# Altium schematic sheet Peripherial_Bus.SchDoc: Peripheral Bus
size Tabloid; Date: 03/13/2023; Engineer: Terry D. Schevker; Revision: 1.0; SheetNumber: 4; SheetTotal: 8
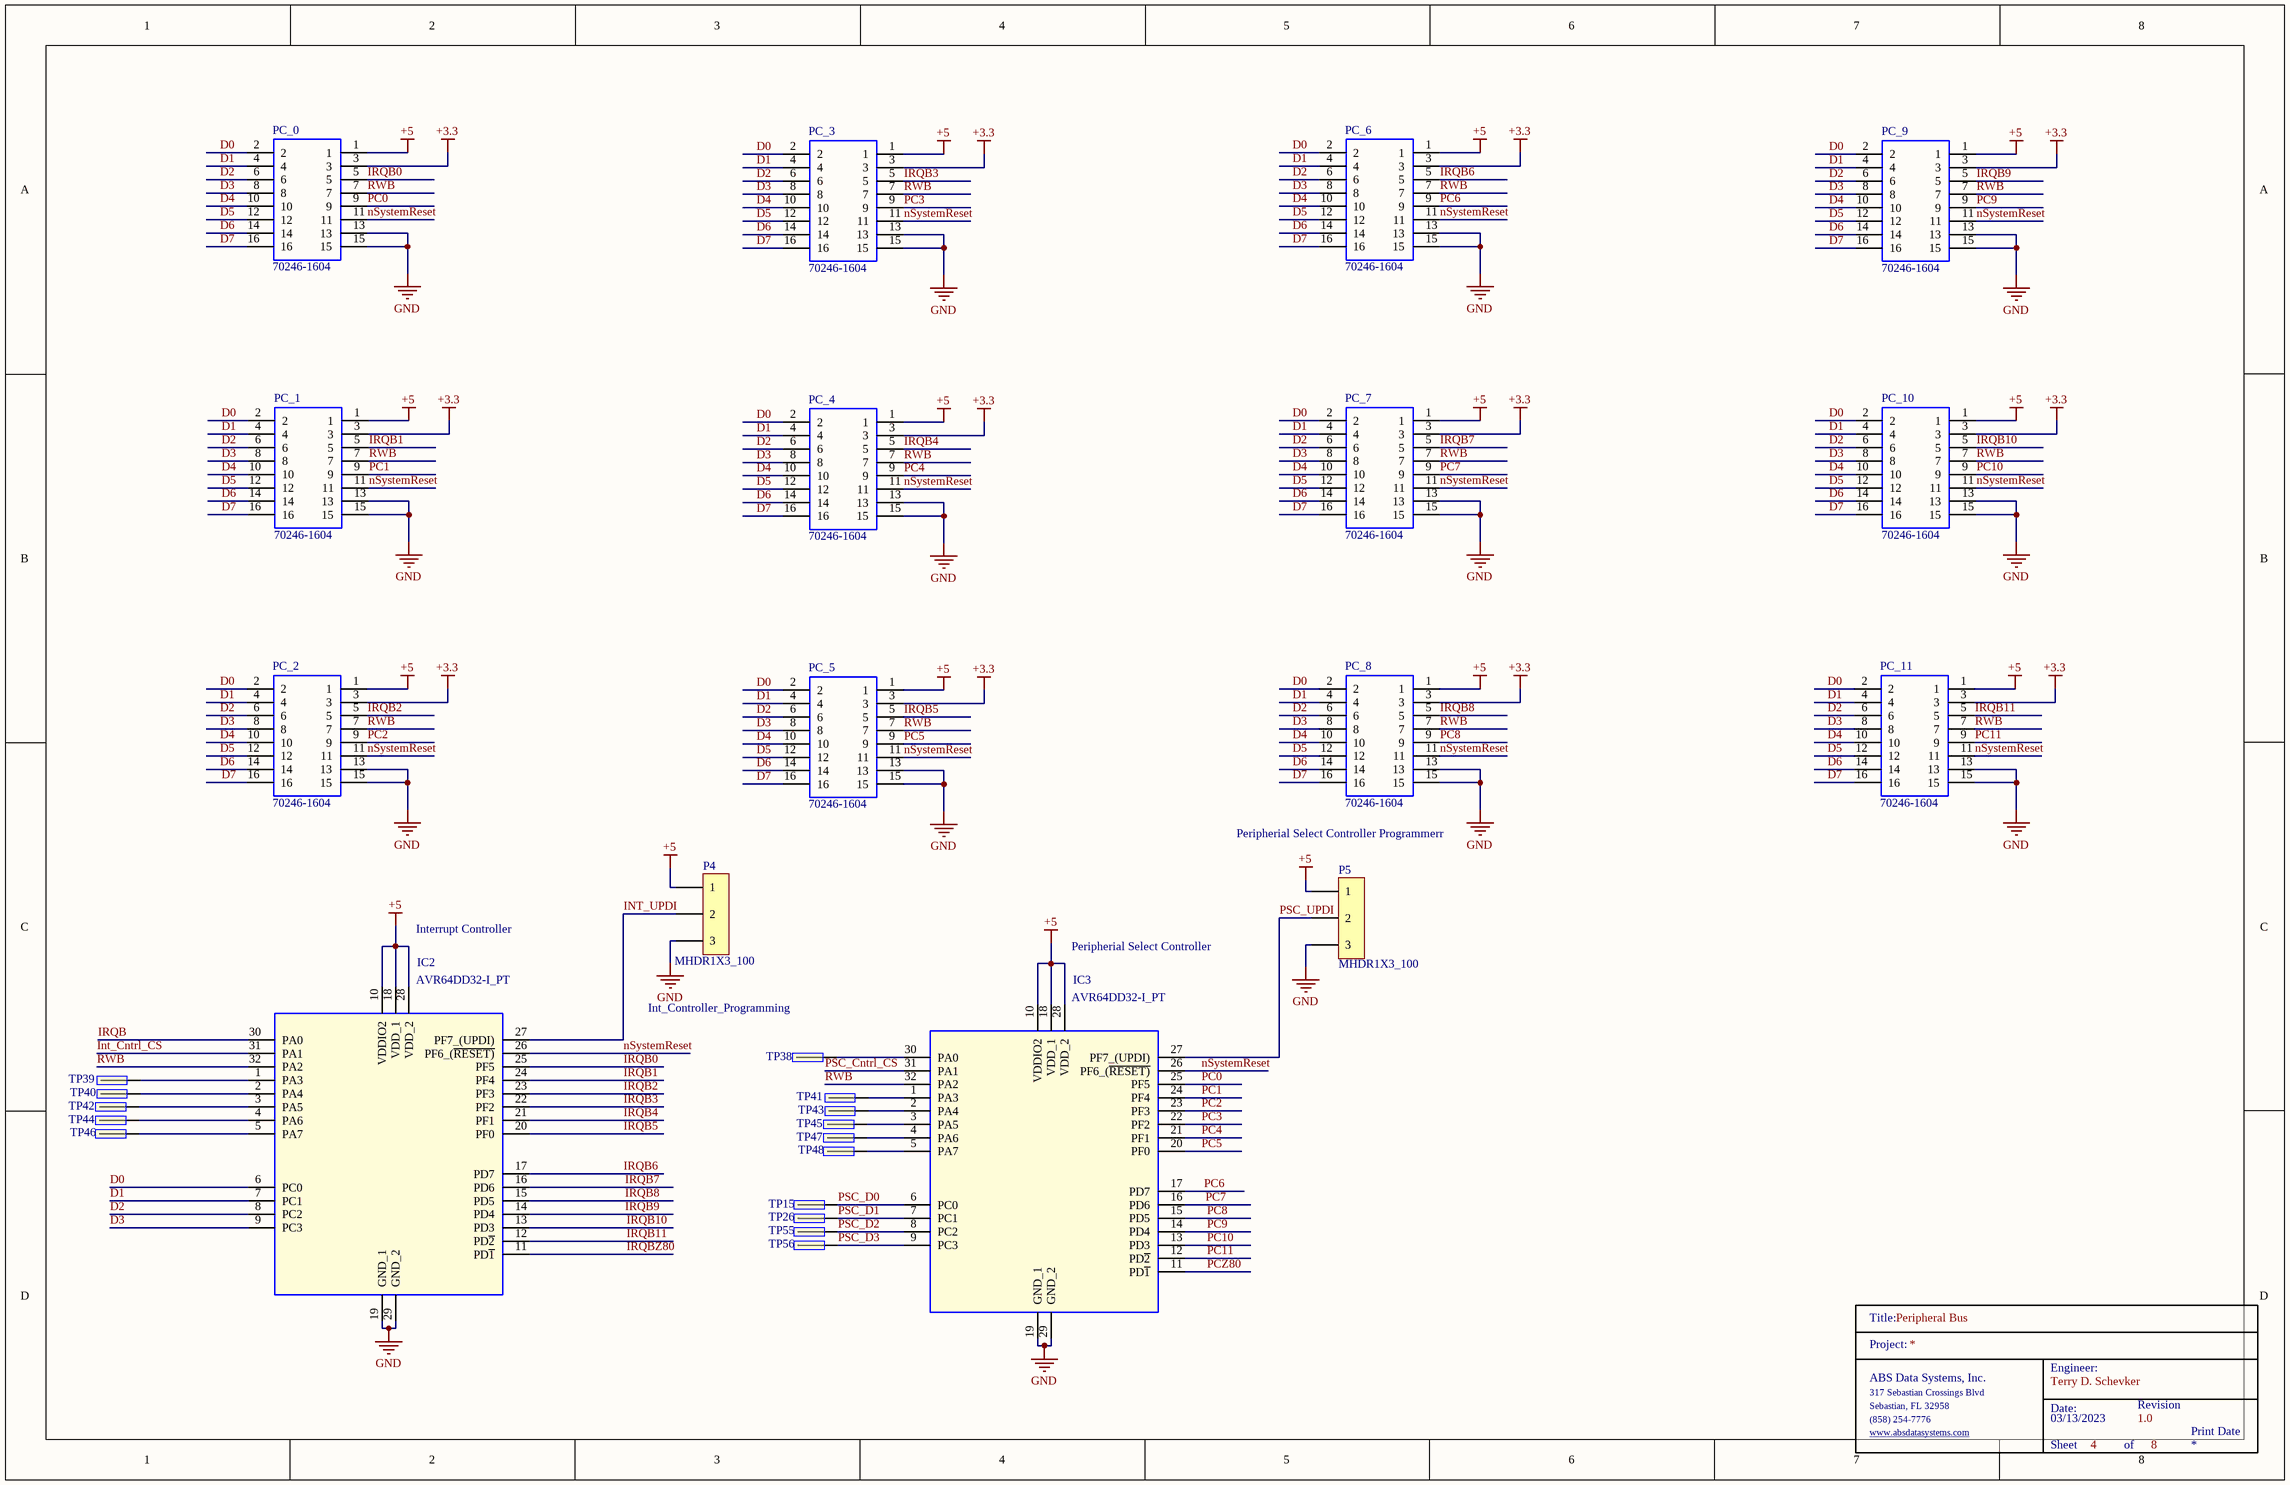
[diagram p0: Peripherial_Bus.SchDoc]

## Parts
IC2  AVR64DD32-I_PT  [QFP80P900X900X120-32N]
IC3  AVR64DD32-I_PT  [QFP80P900X900X120-32N]
P4  MHDR1X3_100  [MHDR1X3_100]
P5  MHDR1X3_100  [MHDR1X3_100]
PC_0  70246-1604  [SHDR16W99P254_2X8_2794X889X927P]
PC_1  70246-1604  [SHDR16W99P254_2X8_2794X889X927P]
PC_2  70246-1604  [SHDR16W99P254_2X8_2794X889X927P]
PC_3  70246-1604  [SHDR16W99P254_2X8_2794X889X927P]
PC_4  70246-1604  [SHDR16W99P254_2X8_2794X889X927P]
PC_5  70246-1604  [SHDR16W99P254_2X8_2794X889X927P]
PC_6  70246-1604  [SHDR16W99P254_2X8_2794X889X927P]
PC_7  70246-1604  [SHDR16W99P254_2X8_2794X889X927P]
PC_8  70246-1604  [SHDR16W99P254_2X8_2794X889X927P]
PC_9  70246-1604  [SHDR16W99P254_2X8_2794X889X927P]
PC_10  70246-1604  [SHDR16W99P254_2X8_2794X889X927P]
PC_11  70246-1604  [SHDR16W99P254_2X8_2794X889X927P]
TitleBlock_6  TitleBlock  (value not drawn)  (graphical)
TP15  TP  [TP]  (value not drawn)
TP26  TP  [TP]  (value not drawn)
TP38  TP  [TP]  (value not drawn)
TP39  TP  [TP]  (value not drawn)
TP40  TP  [TP]  (value not drawn)
TP41  TP  [TP]  (value not drawn)
TP42  TP  [TP]  (value not drawn)
TP43  TP  [TP]  (value not drawn)
TP44  TP  [TP]  (value not drawn)
TP45  TP  [TP]  (value not drawn)
TP46  TP  [TP]  (value not drawn)
TP47  TP  [TP]  (value not drawn)
TP48  TP  [TP]  (value not drawn)
TP55  TP  [TP]  (value not drawn)
TP56  TP  [TP]  (value not drawn)

## Nets
+3.3: PC_0.3 PC_1.3 PC_2.3 PC_3.3 PC_4.3 PC_5.3 PC_6.3 PC_7.3 PC_8.3 PC_9.3 PC_10.3 PC_11.3
+5: IC2.10(VDDIO2) IC2.18(VDD_1) IC2.28(VDD_2) IC3.10(VDDIO2) IC3.18(VDD_1) IC3.28(VDD_2) P4.1 P5.1 PC_0.1 PC_1.1 PC_2.1 PC_3.1 PC_4.1 PC_5.1 PC_6.1 PC_7.1 PC_8.1 PC_9.1 PC_10.1 PC_11.1
GND: IC2.19(GND_1) IC2.29(GND_2) IC3.19(GND_1) IC3.29(GND_2) P4.3 P5.3 PC_0.13 PC_0.15 PC_1.13 PC_1.15 PC_2.13 PC_2.15 PC_3.13 PC_3.15 PC_4.13 PC_4.15 PC_5.13 PC_5.15 PC_6.13 PC_6.15 PC_7.13 PC_7.15 PC_8.13 PC_8.15 PC_9.13 PC_9.15 PC_10.13 PC_10.15 PC_11.13 PC_11.15
D0: IC2.6(PC0) PC_0.2 PC_1.2 PC_2.2 PC_3.2 PC_4.2 PC_5.2 PC_6.2 PC_7.2 PC_8.2 PC_9.2 PC_10.2 PC_11.2
D1: IC2.7(PC1) PC_0.4 PC_1.4 PC_2.4 PC_3.4 PC_4.4 PC_5.4 PC_6.4 PC_7.4 PC_8.4 PC_9.4 PC_10.4 PC_11.4
D2: IC2.8(PC2) PC_0.6 PC_1.6 PC_2.6 PC_3.6 PC_4.6 PC_5.6 PC_6.6 PC_7.6 PC_8.6 PC_9.6 PC_10.6 PC_11.6
D3: IC2.9(PC3) PC_0.8 PC_1.8 PC_2.8 PC_3.8 PC_4.8 PC_5.8 PC_6.8 PC_7.8 PC_8.8 PC_9.8 PC_10.8 PC_11.8
D4: PC_0.10 PC_1.10 PC_2.10 PC_3.10 PC_4.10 PC_5.10 PC_6.10 PC_7.10 PC_8.10 PC_9.10 PC_10.10 PC_11.10
D5: PC_0.12 PC_1.12 PC_2.12 PC_3.12 PC_4.12 PC_5.12 PC_6.12 PC_7.12 PC_8.12 PC_9.12 PC_10.12 PC_11.12
D6: PC_0.14 PC_1.14 PC_2.14 PC_3.14 PC_4.14 PC_5.14 PC_6.14 PC_7.14 PC_8.14 PC_9.14 PC_10.14 PC_11.14
D7: PC_0.16 PC_1.16 PC_2.16 PC_3.16 PC_4.16 PC_5.16 PC_6.16 PC_7.16 PC_8.16 PC_9.16 PC_10.16 PC_11.16
Int_Cntrl_CS: IC2.31(PA1)
INT_UPDI: IC2.27(PF7_(UPDI)) P4.2
IRQB: IC2.30(PA0)
IRQB0: IC2.25(PF5) PC_0.5
IRQB1: IC2.24(PF4) PC_1.5
IRQB2: IC2.23(PF3) PC_2.5
IRQB3: IC2.22(PF2) PC_3.5
IRQB4: IC2.21(PF1) PC_4.5
IRQB5: IC2.20(PF0) PC_5.5
IRQB6: IC2.17(PD7) PC_6.5
IRQB7: IC2.16(PD6) PC_7.5
IRQB8: IC2.15(PD5) PC_8.5
IRQB9: IC2.14(PD4) PC_9.5
IRQB10: IC2.13(PD3) PC_10.5
IRQB11: IC2.12(PD~{2}) PC_11.5
IRQBZ80: IC2.11(PD~{1})
nSystemReset: IC2.26(PF6_(~{RESET)}) IC3.26(PF6_(~{RESET)}) PC_0.11 PC_1.11 PC_2.11 PC_3.11 PC_4.11 PC_5.11 PC_6.11 PC_7.11 PC_8.11 PC_9.11 PC_10.11 PC_11.11
PC0: IC3.25(PF5) PC_0.9
PC1: IC3.24(PF4) PC_1.9
PC2: IC3.23(PF3) PC_2.9
PC3: IC3.22(PF2) PC_3.9
PC4: IC3.21(PF1) PC_4.9
PC5: IC3.20(PF0) PC_5.9
PC6: IC3.17(PD7) PC_6.9
PC7: IC3.16(PD6) PC_7.9
PC8: IC3.15(PD5) PC_8.9
PC9: IC3.14(PD4) PC_9.9
PC10: IC3.13(PD3) PC_10.9
PC11: IC3.12(PD~{2}) PC_11.9
PCZ80: IC3.11(PD~{1})
PSC_Cntrl_CS: IC3.31(PA1)
PSC_D0: IC3.6(PC0) TP15.1
PSC_D1: IC3.7(PC1) TP26.1
PSC_D2: IC3.8(PC2) TP55.1
PSC_D3: IC3.9(PC3) TP56.1
PSC_UPDI: IC3.27(PF7_(UPDI)) P5.2
RWB: IC2.32(PA2) IC3.32(PA2) PC_0.7 PC_1.7 PC_2.7 PC_3.7 PC_4.7 PC_5.7 PC_6.7 PC_7.7 PC_8.7 PC_9.7 PC_10.7 PC_11.7
NetIC2_1: IC2.1(PA3) TP39.1
NetIC2_2: IC2.2(PA4) TP40.1
NetIC2_3: IC2.3(PA5) TP42.1
NetIC2_4: IC2.4(PA6) TP44.1
NetIC2_5: IC2.5(PA7) TP46.1
NetIC3_1: IC3.1(PA3) TP41.1
NetIC3_2: IC3.2(PA4) TP43.1
NetIC3_3: IC3.3(PA5) TP45.1
NetIC3_4: IC3.4(PA6) TP47.1
NetIC3_5: IC3.5(PA7) TP48.1
NetIC3_30: IC3.30(PA0) TP38.1

## Notes on the sheet
- Peripherial Select Controller Programmerr
- Interrupt Controller
- Peripherial Select Controller
- Int_Controller_Programming
- Print Date
- (in symbol TitleBlock) Title:; Project:; Engineer:; ABS Data Systems, Inc.; 317 Sebastian Crossings Blvd; Sebastian, FL 32958; Date:; Revision; (858) 254-7776; www.absdatasystems.com; Sheet; of

## Library data of the parts
IC2 IC3 = AVR64DD32-I_PT: Integrated Circuit; Manufacturer_Name: Microchip; Manufacturer_Part_Number: AVR64DD32-I/PT | MULTI-VOLTAGE I/O; Datasheet Link: https://www.microchip.com/en-us/product/AVR64DD32; Height: 1.2mm
P4 P5 = MHDR1X3_100: Header, 3-Pin; LatestRevisionDate: 17-Jul-2002; LatestRevisionNote: Re-released for DXP Platform.; Publisher: Altium Limited
PC_0-PC_11 = 70246-1604: Molex C-GRID 70246, 2.54mm Pitch, 16 Way, 2 Row, Straight PCB Header, Through Hole; Geometry.Height: 9.27mm; Mouser Part Number: 538-70246-1604; Mouser Price/Stock: https://www.mouser.co.uk/ProductDetail/Molex/70246-1604?qs=KUIzHt%2Fe91njhb67Cjmalw%3D%3D; Manufacturer_Name: Molex; Manufacturer_Part_Number: 70246-1604; Datasheet Link: https://www.molex.com/pdm_docs/sd/702461604_sd.pdf
TP15 TP26 TP38-TP48 TP55 TP56 = TP: Manufacturer: Samtec; Manufacturer Part Number: TST-105-01-G-D; Number of Contacts: 16; Gender: Male; Connector Type: Male Pin; Pitch: 2.54mm; Row Spacing: 0.1inch; Supplier 1: Digi-Key; RoHS: Yes; Category: Headers and Wire Housings; Stock 1: 227; Pricing 1: 1=2.85000, 10=2.73600, 100=2.28000, 500=1.93800, 1000=1.65300, 5000=1.48200 (USD); Mount: Through Hole; Contact Plating: Gold; Contact Material: Bronze; Housing Material: Polyester; Housing Color: Black; Color: Black; Min Operating Temperature: -55°C; Max Operating Temperature: 125°C; Number of Rows: 2; Termination: Solder; Packaging: Rail/Tube; Orientation: Straight; Number of Positions: 16; Length: 27.94mm; Depth: 9.27mm; Contact Mating Length: 0.25inch; REACH SVHC: No SVHC; ComponentLink1URL: https://datasheet.ciiva.com/739/tst-mkt-739845.pdf?src-supplier=Digi-Key; ComponentLink1Description: https://datasheet.ciiva.com/739/tst-mkt-739845.pdf?src-supplier=Digi-Key; ComponentLink2URL: https://datasheet.ciiva.com/10018/htst-10018510.pdf?src-supplier=Avnet; ComponentLink2Description: https://datasheet.ciiva.com/10018/htst-10018510.pdf?src-supplier=Avnet